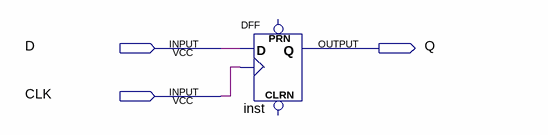
[diagram p0: schematic sheet]
// Quartus schematic dwave.bdf as structural Verilog: 1 symbols, 3 pins
module dwave (
  input  D,
  input  CLK,
  output Q
);

  DFF inst (.CLK(CLK), .D(D), .Q(Q));  // open: CLRN, PRN
endmodule
